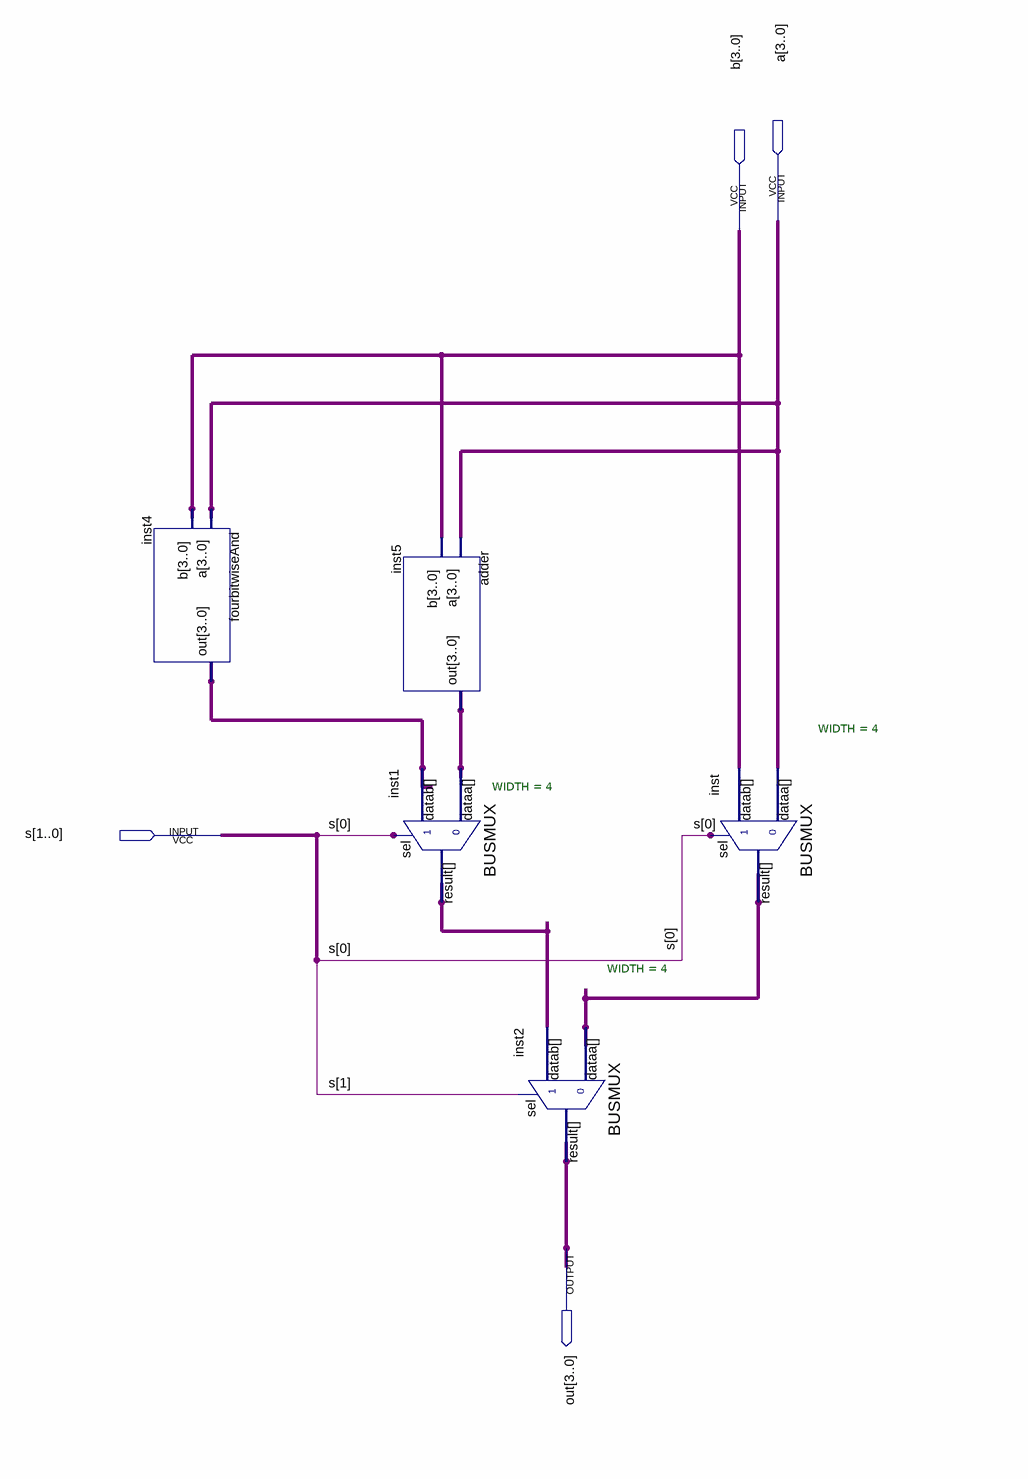
[diagram p0: schematic sheet]
// Quartus schematic ALU.bdf as structural Verilog: 5 symbols, 4 pins
module ALU (
  input  [3:0] a,
  input  [3:0] b,
  input  [1:0] s,
  output [3:0] out
);

  wire [3:0] inst1_result, inst4_out, inst5_out, inst_result;

  fourbitwiseAnd inst4 (.a(a), .b(b), .out(inst4_out));
  adder inst5 (.a(a), .b(b), .out(inst5_out));
  BUSMUX #(.WIDTH(4)) inst1 (.datab(inst4_out), .sel(s[0]), .dataa(inst5_out), .result(inst1_result));
  BUSMUX #(.WIDTH(4)) inst2 (.datab(inst1_result), .sel(s[1]), .dataa(inst_result), .result(out));
  BUSMUX #(.WIDTH(4)) inst (.datab(b), .sel(s[0]), .dataa(a), .result(inst_result));
endmodule
